# EAGLE design APA102 Shield (EAGLE 7.5.0)
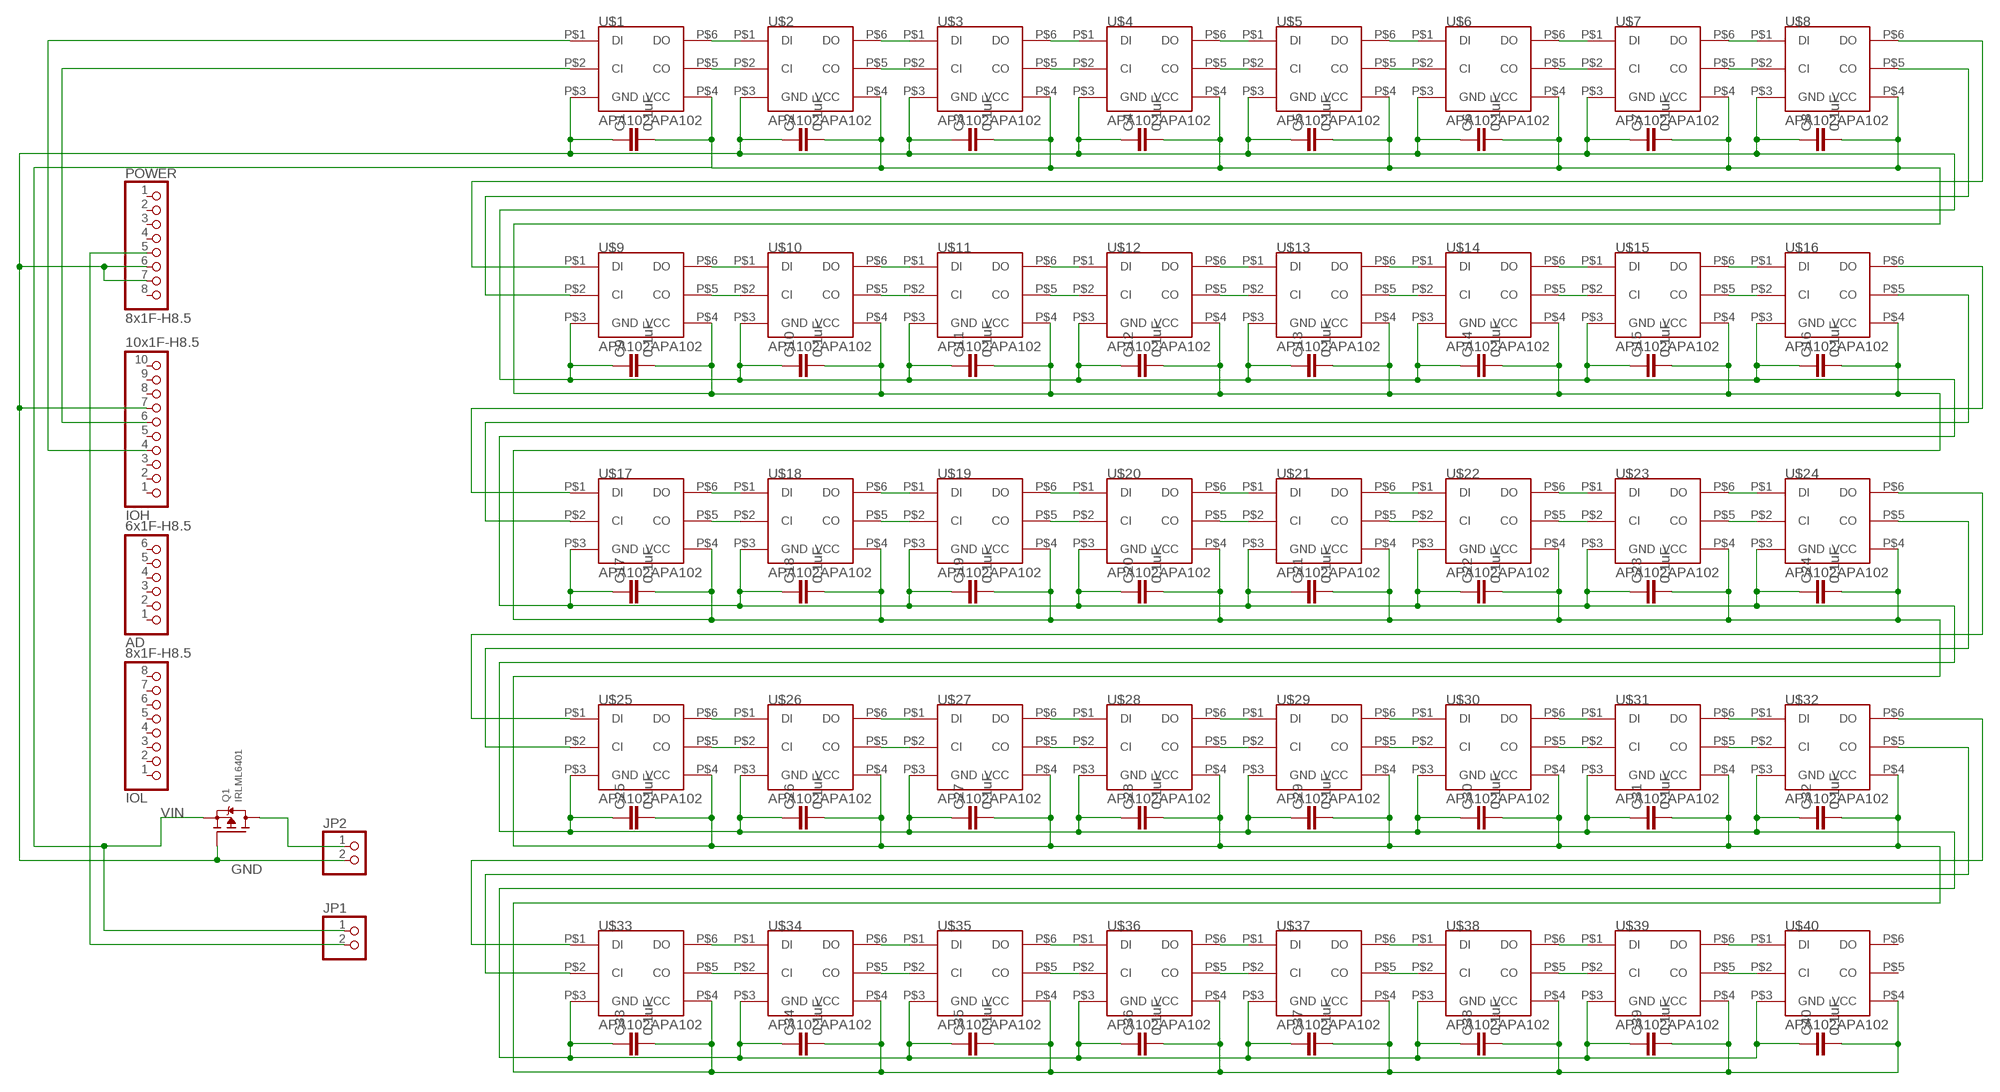
[diagram p0: schematic, sheet 1]

## Parts
AD  6x1F-H8.5  PINHD-1X6  [1X06]
C1  0.1uF  C-EUC1206  [C1206]
C2  0.1uF  C-EUC1206  [C1206]
C3  0.1uF  C-EUC1206  [C1206]
C4  0.1uF  C-EUC1206  [C1206]
C5  0.1uF  C-EUC1206  [C1206]
C6  0.1uF  C-EUC1206  [C1206]
C7  0.1uF  C-EUC1206  [C1206]
C8  0.1uF  C-EUC1206  [C1206]
C9  0.1uF  C-EUC1206  [C1206]
C10  0.1uF  C-EUC1206  [C1206]
C11  0.1uF  C-EUC1206  [C1206]
C12  0.1uF  C-EUC1206  [C1206]
C13  0.1uF  C-EUC1206  [C1206]
C14  0.1uF  C-EUC1206  [C1206]
C15  0.1uF  C-EUC1206  [C1206]
C16  0.1uF  C-EUC1206  [C1206]
C17  0.1uF  C-EUC1206  [C1206]
C18  0.1uF  C-EUC1206  [C1206]
C19  0.1uF  C-EUC1206  [C1206]
C20  0.1uF  C-EUC1206  [C1206]
C21  0.1uF  C-EUC1206  [C1206]
C22  0.1uF  C-EUC1206  [C1206]
C23  0.1uF  C-EUC1206  [C1206]
C24  0.1uF  C-EUC1206  [C1206]
C25  0.1uF  C-EUC1206  [C1206]
C26  0.1uF  C-EUC1206  [C1206]
C27  0.1uF  C-EUC1206  [C1206]
C28  0.1uF  C-EUC1206  [C1206]
C29  0.1uF  C-EUC1206  [C1206]
C30  0.1uF  C-EUC1206  [C1206]
C31  0.1uF  C-EUC1206  [C1206]
C32  0.1uF  C-EUC1206  [C1206]
C33  0.1uF  C-EUC1206  [C1206]
C34  0.1uF  C-EUC1206  [C1206]
C35  0.1uF  C-EUC1206  [C1206]
C36  0.1uF  C-EUC1206  [C1206]
C37  0.1uF  C-EUC1206  [C1206]
C38  0.1uF  C-EUC1206  [C1206]
C39  0.1uF  C-EUC1206  [C1206]
C40  0.1uF  C-EUC1206  [C1206]
IOH  10x1F-H8.5  PINHD-1X10_ARD  [1X10]
IOL  8x1F-H8.5  PINHD-1X8  [1X08]
JP1  PINHD-1X2  [1X02]
JP2  PINHD-1X2  [1X02]
POWER  8x1F-H8.5  PINHD-1X8  [1X08]
Q1  IRLML6401  MOSFET-PWIDE  [SOT23-WIDE]
U$1  APA102APA102  [5050]
U$2  APA102APA102  [5050]
U$3  APA102APA102  [5050]
U$4  APA102APA102  [5050]
U$5  APA102APA102  [5050]
U$6  APA102APA102  [5050]
U$7  APA102APA102  [5050]
U$8  APA102APA102  [5050]
U$9  APA102APA102  [5050]
U$10  APA102APA102  [5050]
U$11  APA102APA102  [5050]
U$12  APA102APA102  [5050]
U$13  APA102APA102  [5050]
U$14  APA102APA102  [5050]
U$15  APA102APA102  [5050]
U$16  APA102APA102  [5050]
U$17  APA102APA102  [5050]
U$18  APA102APA102  [5050]
U$19  APA102APA102  [5050]
U$20  APA102APA102  [5050]
U$21  APA102APA102  [5050]
U$22  APA102APA102  [5050]
U$23  APA102APA102  [5050]
U$24  APA102APA102  [5050]
U$25  APA102APA102  [5050]
U$26  APA102APA102  [5050]
U$27  APA102APA102  [5050]
U$28  APA102APA102  [5050]
U$29  APA102APA102  [5050]
U$30  APA102APA102  [5050]
U$31  APA102APA102  [5050]
U$32  APA102APA102  [5050]
U$33  APA102APA102  [5050]
U$34  APA102APA102  [5050]
U$35  APA102APA102  [5050]
U$36  APA102APA102  [5050]
U$37  APA102APA102  [5050]
U$38  APA102APA102  [5050]
U$39  APA102APA102  [5050]
U$40  APA102APA102  [5050]

## Nets
GND: C1.1 C2.1 C3.1 C4.1 C5.1 C6.1 C7.1 C8.1 C9.1 C10.1 C11.1 C12.1 C13.1 C14.1 C15.1 C16.1 C17.1 C18.1 C19.1 C20.1 C21.1 C22.1 C23.1 C24.1 C25.1 C26.1 C27.1 C28.1 C29.1 C30.1 C31.1 C32.1 C33.1 C34.1 C35.1 C36.1 C37.1 C38.1 C39.1 C40.1 IOH.7 JP2.2 POWER.6 POWER.7 Q1.1(G) U$1.P$3(GND) U$2.P$3(GND) U$3.P$3(GND) U$4.P$3(GND) U$5.P$3(GND) U$6.P$3(GND) U$7.P$3(GND) U$8.P$3(GND) U$9.P$3(GND) U$10.P$3(GND) U$11.P$3(GND) U$12.P$3(GND) U$13.P$3(GND) U$14.P$3(GND) U$15.P$3(GND) U$16.P$3(GND) U$17.P$3(GND) U$18.P$3(GND) U$19.P$3(GND) U$20.P$3(GND) U$21.P$3(GND) U$22.P$3(GND) U$23.P$3(GND) U$24.P$3(GND) U$25.P$3(GND) U$26.P$3(GND) U$27.P$3(GND) U$28.P$3(GND) U$29.P$3(GND) U$30.P$3(GND) U$31.P$3(GND) U$32.P$3(GND) U$33.P$3(GND) U$34.P$3(GND) U$35.P$3(GND) U$36.P$3(GND) U$37.P$3(GND) U$38.P$3(GND) U$39.P$3(GND) U$40.P$3(GND)
N$2: IOH.4 U$1.P$1(DI)
N$3: U$15.P$5(CO) U$16.P$2(CI)
N$4: U$23.P$6(DO) U$24.P$1(DI)
N$5: U$15.P$6(DO) U$16.P$1(DI)
N$6: IOH.6 U$1.P$2(CI)
N$7: U$14.P$6(DO) U$15.P$1(DI)
N$8: U$14.P$5(CO) U$15.P$2(CI)
N$9: U$7.P$6(DO) U$8.P$1(DI)
N$10: U$7.P$5(CO) U$8.P$2(CI)
N$11: U$6.P$6(DO) U$7.P$1(DI)
N$12: U$6.P$5(CO) U$7.P$2(CI)
N$13: U$5.P$6(DO) U$6.P$1(DI)
N$14: U$5.P$5(CO) U$6.P$2(CI)
N$15: U$4.P$6(DO) U$5.P$1(DI)
N$16: U$4.P$5(CO) U$5.P$2(CI)
N$17: U$3.P$6(DO) U$4.P$1(DI)
N$18: U$3.P$5(CO) U$4.P$2(CI)
N$19: U$2.P$6(DO) U$3.P$1(DI)
N$20: U$2.P$5(CO) U$3.P$2(CI)
N$21: U$1.P$6(DO) U$2.P$1(DI)
N$22: U$1.P$5(CO) U$2.P$2(CI)
N$23: U$23.P$5(CO) U$24.P$2(CI)
N$24: U$13.P$6(DO) U$14.P$1(DI)
N$25: U$22.P$6(DO) U$23.P$1(DI)
N$26: U$13.P$5(CO) U$14.P$2(CI)
N$27: U$12.P$6(DO) U$13.P$1(DI)
N$28: U$12.P$5(CO) U$13.P$2(CI)
N$29: U$11.P$6(DO) U$12.P$1(DI)
N$30: U$11.P$5(CO) U$12.P$2(CI)
N$31: U$10.P$6(DO) U$11.P$1(DI)
N$32: U$10.P$5(CO) U$11.P$2(CI)
N$33: U$9.P$6(DO) U$10.P$1(DI)
N$34: U$9.P$5(CO) U$10.P$2(CI)
N$35: U$22.P$5(CO) U$23.P$2(CI)
N$36: U$16.P$5(CO) U$17.P$2(CI)
N$37: U$8.P$5(CO) U$9.P$2(CI)
N$38: U$8.P$6(DO) U$9.P$1(DI)
N$39: U$16.P$6(DO) U$17.P$1(DI)
N$40: U$39.P$6(DO) U$40.P$1(DI)
N$41: U$21.P$6(DO) U$22.P$1(DI)
N$42: U$21.P$5(CO) U$22.P$2(CI)
N$43: U$20.P$6(DO) U$21.P$1(DI)
N$44: U$20.P$5(CO) U$21.P$2(CI)
N$45: U$19.P$6(DO) U$20.P$1(DI)
N$46: U$19.P$5(CO) U$20.P$2(CI)
N$47: U$18.P$6(DO) U$19.P$1(DI)
N$48: U$18.P$5(CO) U$19.P$2(CI)
N$49: U$17.P$6(DO) U$18.P$1(DI)
N$50: U$17.P$5(CO) U$18.P$2(CI)
N$51: U$39.P$5(CO) U$40.P$2(CI)
N$52: U$38.P$6(DO) U$39.P$1(DI)
N$53: U$31.P$6(DO) U$32.P$1(DI)
N$54: U$31.P$5(CO) U$32.P$2(CI)
N$55: U$30.P$6(DO) U$31.P$1(DI)
N$56: U$30.P$5(CO) U$31.P$2(CI)
N$57: U$29.P$6(DO) U$30.P$1(DI)
N$58: U$29.P$5(CO) U$30.P$2(CI)
N$59: U$28.P$6(DO) U$29.P$1(DI)
N$60: U$28.P$5(CO) U$29.P$2(CI)
N$61: U$27.P$6(DO) U$28.P$1(DI)
N$62: U$27.P$5(CO) U$28.P$2(CI)
N$63: U$26.P$6(DO) U$27.P$1(DI)
N$64: U$26.P$5(CO) U$27.P$2(CI)
N$65: U$25.P$6(DO) U$26.P$1(DI)
N$66: U$25.P$5(CO) U$26.P$2(CI)
N$67: U$38.P$5(CO) U$39.P$2(CI)
N$69: U$24.P$5(CO) U$25.P$2(CI)
N$70: U$24.P$6(DO) U$25.P$1(DI)
N$71: JP1.2 POWER.5
N$72: JP2.1 Q1.3(D)
N$73: U$37.P$6(DO) U$38.P$1(DI)
N$74: U$37.P$5(CO) U$38.P$2(CI)
N$75: U$36.P$6(DO) U$37.P$1(DI)
N$76: U$36.P$5(CO) U$37.P$2(CI)
N$77: U$35.P$6(DO) U$36.P$1(DI)
N$78: U$35.P$5(CO) U$36.P$2(CI)
N$79: U$34.P$6(DO) U$35.P$1(DI)
N$80: U$34.P$5(CO) U$35.P$2(CI)
N$81: U$33.P$6(DO) U$34.P$1(DI)
N$82: U$33.P$5(CO) U$34.P$2(CI)
N$85: U$32.P$5(CO) U$33.P$2(CI)
N$86: U$32.P$6(DO) U$33.P$1(DI)
VIN: C1.2 C2.2 C3.2 C4.2 C5.2 C6.2 C7.2 C8.2 C9.2 C10.2 C11.2 C12.2 C13.2 C14.2 C15.2 C16.2 C17.2 C18.2 C19.2 C20.2 C21.2 C22.2 C23.2 C24.2 C25.2 C26.2 C27.2 C28.2 C29.2 C30.2 C31.2 C32.2 C33.2 C34.2 C35.2 C36.2 C37.2 C38.2 C39.2 C40.2 JP1.1 Q1.2(S) U$1.P$4(VCC) U$2.P$4(VCC) U$3.P$4(VCC) U$4.P$4(VCC) U$5.P$4(VCC) U$6.P$4(VCC) U$7.P$4(VCC) U$8.P$4(VCC) U$9.P$4(VCC) U$10.P$4(VCC) U$11.P$4(VCC) U$12.P$4(VCC) U$13.P$4(VCC) U$14.P$4(VCC) U$15.P$4(VCC) U$16.P$4(VCC) U$17.P$4(VCC) U$18.P$4(VCC) U$19.P$4(VCC) U$20.P$4(VCC) U$21.P$4(VCC) U$22.P$4(VCC) U$23.P$4(VCC) U$24.P$4(VCC) U$25.P$4(VCC) U$26.P$4(VCC) U$27.P$4(VCC) U$28.P$4(VCC) U$29.P$4(VCC) U$30.P$4(VCC) U$31.P$4(VCC) U$32.P$4(VCC) U$33.P$4(VCC) U$34.P$4(VCC) U$35.P$4(VCC) U$36.P$4(VCC) U$37.P$4(VCC) U$38.P$4(VCC) U$39.P$4(VCC) U$40.P$4(VCC)
Unconnected: AD.1 AD.2 AD.3 AD.4 AD.5 AD.6 IOH.1 IOH.2 IOH.3 IOH.5 IOH.8 IOH.9 IOH.10 IOL.1 IOL.2 IOL.3 IOL.4 IOL.5 IOL.6 IOL.7 IOL.8 POWER.1 POWER.2 POWER.3 POWER.4 POWER.8 U$40.P$5(CO) U$40.P$6(DO)

## Library data of the parts
AD = SmartPrj:PINHD-1X6: PIN HEADER
C1-C40 = rcl:C-EU: CAPACITOR, European symbol
IOH = SmartPrj:PINHD-1X10_ARD: PIN HEADER
IOL POWER = SmartPrj:PINHD-1X8: PIN HEADER
JP1 JP2 = pinhead:PINHD-1X2: PIN HEADER
Q1 = microbuilder:MOSFET-P: P-Channel Mosfet LEGEND VDS: Voltage Drain-Source ID: Drain Current RDS(ON): Drain-Source On-State Resistance VGS(TH): Gate-Source Threshold Voltage CISS: Drain-Source Input Capacitance SOT-23 Name VDS ID RDS(ON) VGS(TH) CISS Order Number IRLML5103 30V 760mA 600 mOhm -- 75pF @ 25V Digikey: IRLML5103PBFCT-ND NTR0202PL 20V 400mA 800 mOhm 2.3V @ 250uA 70pF @ 5V Digikey: NTR0202PLT1GOSTR-ND NTR4101PT1G 20V 1.8A 85 mOhm 1.2V @ 250uA 675pF @ 10V Digikey: NTR4101PT1GOSCT-ND DMP2004K 20V 600mA 900 mOhm 1V @ 250uA 175pF @ 16V Digikey: DMP2004KDICT-ND PMV65XP 20V 3.9A 76 mOhm 950mV @ 1mA 725pF @ 20V Digikey: 568-2358-2-ND TO-252 Name VDS ID RDS(ON) VGS(TH) CISS Order Number AOD417 30V 25A 34 mOhm 3V @ 250µA 920pF @ 15V Digikey: 785-1106-2-ND
U$1-U$40 = Joe:APA102

## Net classes
1 power: width 0.61 mm, drill 0.61 mm, clearance 0.254 mm
2 gnd: width 0.305 mm, drill 0.559 mm, clearance 0.254 mm
3 usbvcc: width 0.508 mm, drill 0.61 mm, clearance 0.254 mm
4 aref: width 0.406 mm, drill 0.61 mm, clearance 0.254 mm

## Board
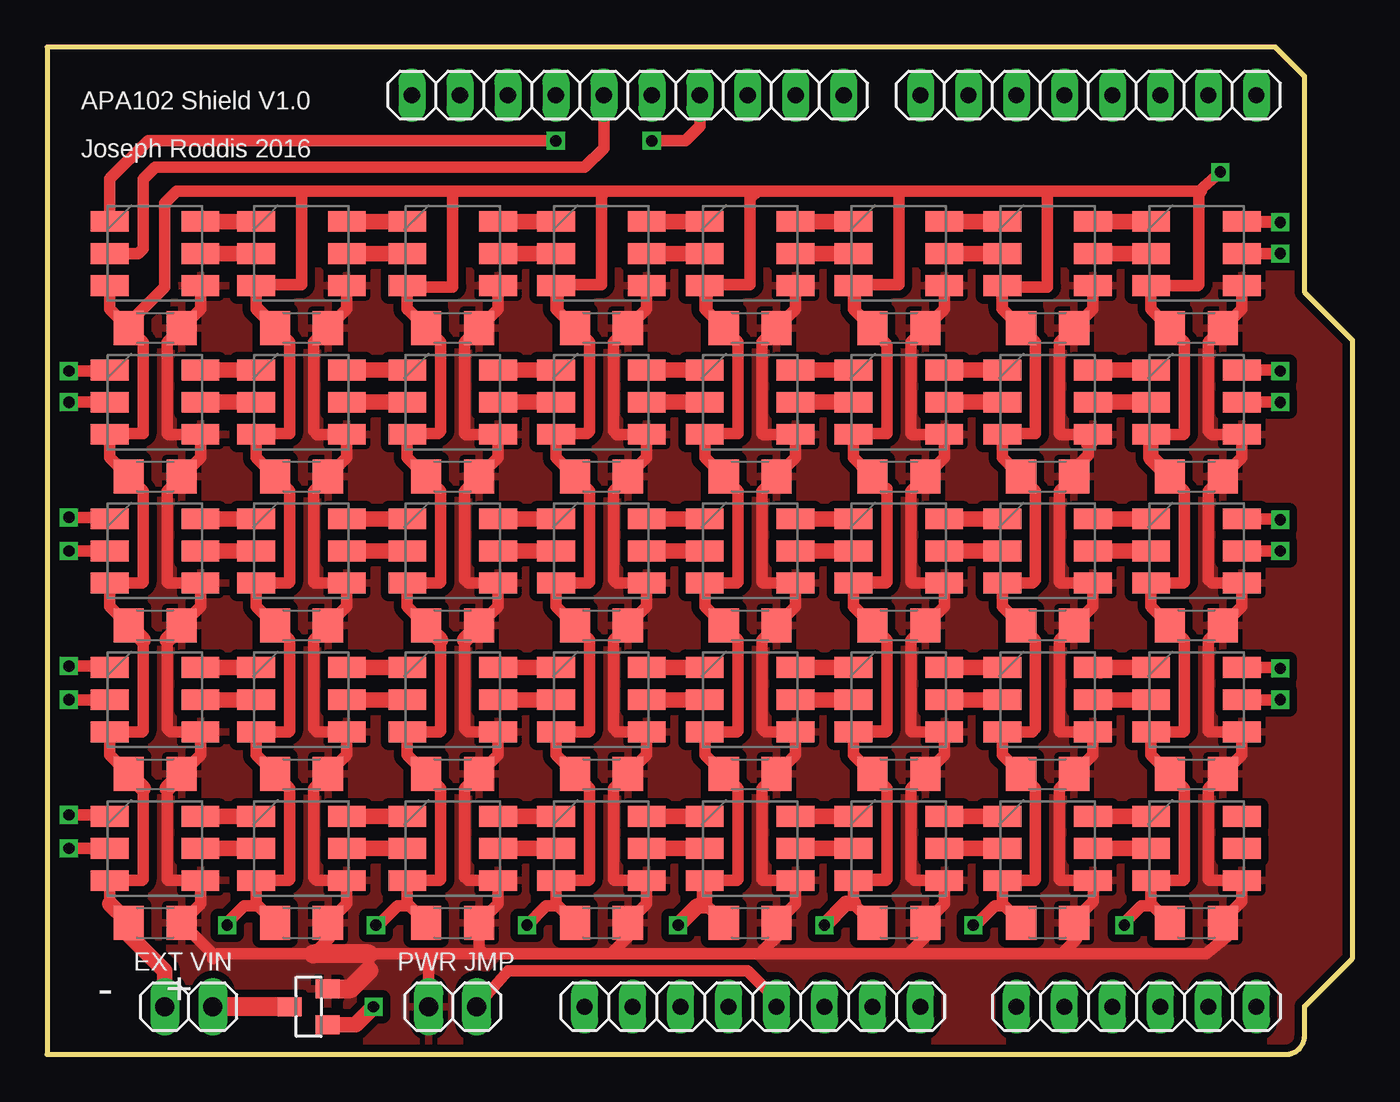
[diagram p1: board, top side]
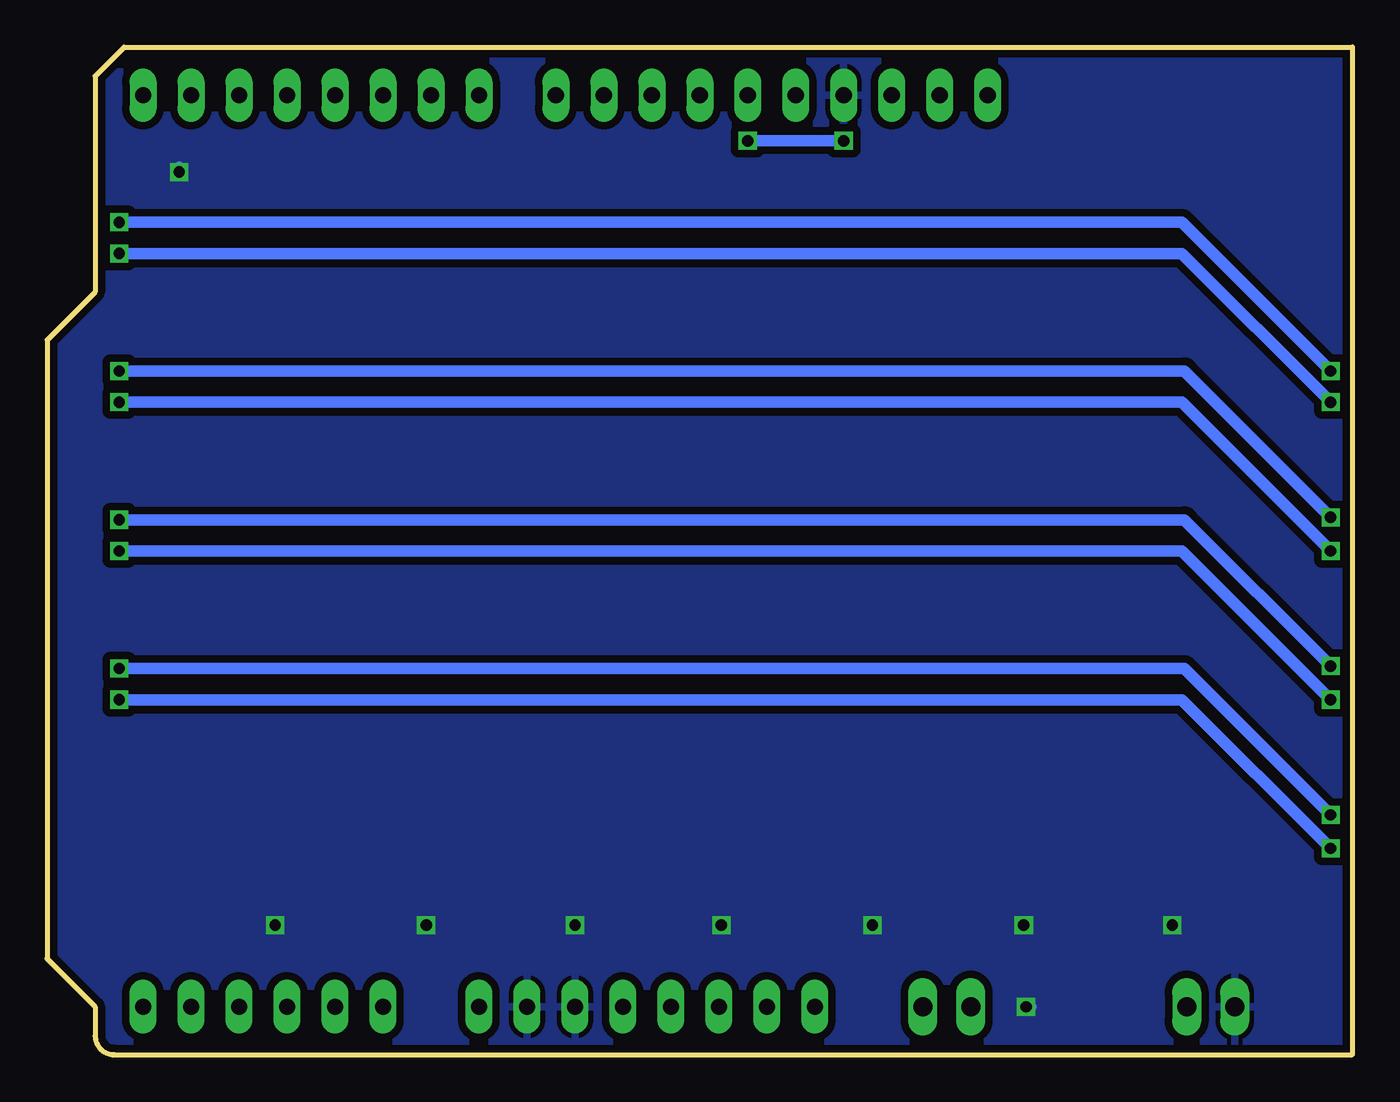
[diagram p2: board, bottom side, seen from below]

Size 69.09 x 53.34 mm. Coordinates in mm from the lower left corner, seen from the top.
Outline: 65.55,0 arc90 66.55,1 66.55,2.54 69.09,5.08 69.09,37.85 66.55,40.39 66.55,51.82 65.02,53.34 0,53.34 0,0 65.53,0
Copper layers (1*16): Top 0.0356mm / dielectric 1.5011mm / Bottom 0.0356mm
Design rules "oshpark-2layer": minimum track width 6mil, minimum drill 13mil, track to track 6mil, track to pad 6mil, pad to pad 6mil, via to via 6mil, smd to smd 6mil, copper to edge 15mil, drill to drill 6mil, minimum pad ring 7mil, minimum via ring 7mil, stop-mask expansion 2.5mil, vias tented up to drill 0mil, thermal gap 10mil
vRestrict: area 23.4,44.1 to 25.1,49.1; area 25.9,45.5 to 27.6,49.1; area 29,45.3 to 30.1,48.8; area 31.5,45.3 to 32.6,48.8; area 34,45.3 to 35.2,48.8; area 36.6,45.3 to 37.7,48.8; area 39.2,47.2 to 40.4,48.8; area 40.8,45.1 to 48.1,46.9; area 60.8,44.2 to 62.2,46.7; area 63.4,44.2 to 64.8,46.7; area 61.8,35.8 to 65.3,37.2; area 1.1,21.8 to 2.5,30.1; 14 more areas

### Footprints (pad centres in the part's own frame; a part is rotated, then mirrored left to right if it is on the bottom)
1X06 = drill 0.85 pad 1.422 long: 1 -6.35,0; 2 -3.81,0; 3 -1.27,0; 4 1.27,0; 5 3.81,0; 6 6.35,0
C1206 = smd 1.6 x 1.8: 1 -1.4,0; 2 1.4,0
1X10 = drill 0.85 pad 1.422 long: 1 -11.43,0; 2 -8.89,0; 3 -6.35,0; 4 -3.81,0; 5 -1.27,0; 6 1.27,0; 7 3.81,0; 8 6.35,0; 9 8.89,0; 10 11.43,0
1X08 = drill 0.85 pad 1.422 long: 1 -8.89,0; 2 -6.35,0; 3 -3.81,0; 4 -1.27,0; 5 1.27,0; 6 3.81,0; 7 6.35,0; 8 8.89,0
1X02 = drill 1.016 long: 1 -1.27,0; 2 1.27,0
SOT23-WIDE = smd 1 x 1.27: 1 -0.95,-1; 2 0.95,-1; 3 0,1
5050 = smd 2 x 1.1: P$1 -2.4,1.7; P$2 -2.4,0; P$3 -2.4,-1.7; P$4 2.4,-1.7; P$5 2.4,0; P$6 2.4,1.7

### Placement (x,y rotation side)
AD  57.66,2.54 0 top
C1  5.71,38.48 0 top
C2  13.46,38.48 0 top
C3  21.46,38.48 0 top
C4  29.34,38.48 0 top
C5  37.21,38.48 0 top
C6  45.09,38.48 0 top
C7  52.96,38.48 0 top
C8  60.83,38.48 0 top
C9  5.71,30.61 0 top
C10  13.46,30.61 0 top
C11  21.46,30.61 0 top
C12  29.34,30.61 0 top
C13  37.21,30.61 0 top
C14  45.09,30.61 0 top
C15  52.96,30.61 0 top
C16  60.83,30.61 0 top
C17  5.71,22.73 0 top
C18  13.46,22.73 0 top
C19  21.46,22.73 0 top
C20  29.34,22.73 0 top
C21  37.21,22.73 0 top
C22  45.09,22.73 0 top
C23  52.96,22.73 0 top
C24  60.83,22.73 0 top
C25  5.71,14.86 0 top
C26  13.46,14.86 0 top
C27  21.46,14.86 0 top
C28  29.34,14.86 0 top
C29  37.21,14.86 0 top
C30  45.09,14.86 0 top
C31  52.96,14.86 0 top
C32  60.83,14.86 0 top
C33  5.71,6.99 0 top
C34  13.46,6.99 0 top
C35  21.46,6.99 0 top
C36  29.34,6.99 0 top
C37  37.21,6.99 0 top
C38  45.09,6.99 0 top
C39  52.96,6.99 0 top
C40  60.83,6.99 0 top
IOH  30.73,50.8 180 top
IOL  55.12,50.8 180 top
JP1  21.46,2.54 0 top
JP2  7.49,2.54 180 top
POWER  37.34,2.54 0 top
Q1  13.84,2.54 90 top
U$1  5.71,42.42 0 top
U$2  13.46,42.42 0 top
U$3  21.46,42.42 0 top
U$4  29.34,42.42 0 top
U$5  37.21,42.42 0 top
U$6  45.09,42.42 0 top
U$7  52.96,42.42 0 top
U$8  60.83,42.42 0 top
U$9  5.71,34.54 0 top
U$10  13.46,34.54 0 top
U$11  21.46,34.54 0 top
U$12  29.34,34.54 0 top
U$13  37.21,34.54 0 top
U$14  45.09,34.54 0 top
U$15  52.96,34.54 0 top
U$16  60.83,34.54 0 top
U$17  5.71,26.67 0 top
U$18  13.46,26.67 0 top
U$19  21.46,26.67 0 top
U$20  29.34,26.67 0 top
U$21  37.21,26.67 0 top
U$22  45.09,26.67 0 top
U$23  52.96,26.67 0 top
U$24  60.83,26.67 0 top
U$25  5.71,18.8 0 top
U$26  13.46,18.8 0 top
U$27  21.46,18.8 0 top
U$28  29.34,18.8 0 top
U$29  37.21,18.8 0 top
U$30  45.09,18.8 0 top
U$31  52.96,18.8 0 top
U$32  60.83,18.8 0 top
U$33  5.71,10.92 0 top
U$34  13.46,10.92 0 top
U$35  21.46,10.92 0 top
U$36  29.34,10.92 0 top
U$37  37.21,10.92 0 top
U$38  45.09,10.92 0 top
U$39  52.96,10.92 0 top
U$40  60.83,10.92 0 top

### Tracks (layer width: path | path; a pad name or v marks a point on that pad's centre or on a via)
GND  (via drill 0.6)
  Top 0.61: U$1.P$3 3.31,39.48 C1.1 | U$2.P$3 11.06,39.48 C2.1 | U$7.P$3 50.56,39.48 C7.1 | U$6.P$3 42.69,39.48 C6.1 | U$5.P$3 34.81,39.48 C5.1 | U$4.P$3 26.94,39.48 C4.1 | C17.1 3.31,23.73 U$17.P$3 5.03,24.97 5.08,25.02 5.08,29.84 C9.1 3.31,31.61 U$9.P$3 3.36,32.89 5.08,32.89 5.08,37.72 C1.1 | C25.1 3.31,15.86 U$25.P$3 5.03,17.1 5.08,17.14 5.08,21.97 | 3.31,7.99 U$33.P$3 5.03,9.22 5.08,9.27 5.08,14.1 | 3.68,7.62 C33.1 4.31,6.35 | 11.06,8.13 U$34.P$3 12.78,9.22 12.83,9.27 12.83,14.1 12.82,14.1 C26.1 11.06,15.86 U$26.P$3 12.78,17.1 12.83,17.14 12.83,21.97 12.82,21.97 C18.1 11.06,23.73 U$18.P$3 12.78,24.97 12.83,25.02 12.83,29.84 C10.1 11.06,31.61 U$10.P$3 11.11,32.89 12.83,32.89 12.83,37.72 C2.1 | 11.06,8.13 11.06,7.99 C34.1 | 19.17,7.87 19.06,7.99 U$35.P$3 20.78,9.22 20.83,9.27 20.83,14.09 C27.1 19.06,15.86 U$27.P$3 20.78,17.1 20.83,17.14 20.83,21.97 | 19.17,7.87 C35.1 | C36.1 26.94,7.99 U$36.P$3 28.65,9.22 28.7,9.27 28.7,14.1 C28.1 26.94,15.86 U$28.P$3 28.65,17.1 28.7,17.14 28.7,21.97 C20.1 26.94,23.73 U$20.P$3 28.65,24.97 28.7,25.02 28.7,29.84 C12.1 26.94,31.61 U$12.P$3 26.99,32.89 28.57,32.89 28.7,33.02 28.7,37.72 C4.1 | C37.1 34.81,7.99 U$37.P$3 36.53,9.22 36.58,9.27 36.58,14.09 C29.1 34.81,15.86 U$29.P$3 36.53,17.1 36.58,17.14 36.58,21.97 C21.1 34.81,23.73 U$21.P$3 36.53,24.97 36.58,25.02 36.58,29.84 C13.1 34.81,31.61 U$13.P$3 34.86,32.89 36.58,32.89 36.58,37.72 C5.1 | 42.69,7.99 U$38.P$3 44.4,9.22 44.45,9.27 44.45,9.4 | 42.69,7.99 43.05,7.62 | 43.05,7.62 C38.1 43.05,7.62 | 50.61,7.94 50.56,7.99 U$39.P$3 52.28,9.22 52.32,9.27 52.32,14.09 C31.1 50.56,15.86 U$31.P$3 52.15,17.1 52.32,17.27 52.32,21.97 C23.1 50.56,23.73 U$23.P$3 52.15,24.97 52.32,25.15 52.32,29.84 C15.1 50.56,31.61 U$15.P$3 50.61,32.89 52.32,32.89 52.32,37.72 C7.1
  Top 0.61: 50.61,7.94 C39.1 | 58.43,7.99 U$40.P$3 60.15,9.22 60.2,9.27 60.2,14.09 C32.1 58.43,15.86 U$32.P$3 60.15,17.1 60.2,17.14 60.2,21.97 C24.1 58.43,23.73 U$24.P$3 60.15,24.97 60.2,25.02 60.2,29.84 C16.1 | 58.43,7.99 C40.1 | C19.1 19.06,23.73 U$19.P$3 20.78,24.97 20.83,25.02 20.83,29.84 C11.1 19.06,31.61 U$11.P$3 19.11,32.89 20.7,32.89 20.83,33.02 20.83,37.72 C3.1 | 44.45,29.84 C14.1 42.69,31.61 U$14.P$3 42.73,32.89 44.45,32.89 44.45,37.59 43.69,38.36 C6.1 | 44.45,29.84 44.45,25.15 | 44.45,25.15 44.45,25.02 44.4,24.97 U$22.P$3 42.69,23.73 C22.1 44.45,21.97 | 44.45,21.97 44.45,17.14 | 44.45,17.14 44.4,17.1 U$30.P$3 42.69,15.86 C30.1 44.45,14.09 | 44.45,14.09 44.45,9.4 | U$16.P$3 60.15,32.84 60.2,32.89 60.2,37.72 C8.1 58.43,39.48 U$8.P$3 60.91,40.72 60.96,40.77 60.96,45.59 | U$3.P$3 19.06,39.48 19.18,39.37 C3.1 | C1.1 4.31,38.73 6.22,40.64 6.22,45.09 6.86,45.72 13.46,45.72 | 13.46,45.72 21.46,45.72 | 21.46,45.72 29.59,45.72 | 29.59,45.72 37.59,45.72 | 37.59,45.72 45.09,45.72 | 45.09,45.72 53.09,45.72 | 53.09,45.72 60.83,45.72 60.96,45.59 | C7.1 50.55,39.5 50.55,40.64 52.96,40.64 52.96,45.59 53.09,45.72 | C6.1 42.8,39.37 42.8,40.64 42.67,40.77 45.09,40.77 45.09,45.72 | C5.1 34.93,39.37 34.93,40.77 37.21,40.77 37.21,45.34 37.59,45.72 | C4.1 27.05,39.37 27.05,40.64 26.92,40.77 29.34,40.77 29.34,45.47 29.59,45.72 | C3.1 19.05,39.5 19.05,40.64 21.46,40.64 21.46,45.72 | C2.1 12.06,38.61 11.18,39.5 11.05,39.5 11.05,40.77 13.46,40.77 13.46,45.72 | 61.09,45.72 60.96,45.59 | 42.69,7.99 42.67,8 42.67,9.27 43.18,9.27 43.31,9.14 43.31,9.27 44.32,9.27 44.45,9.4 | 44.45,14.09 44.45,14.1 42.67,15.88 42.67,17.02 43.05,17.02
  Top 0.61: 43.05,17.02 43.18,17.14 43.31,17.14 | 43.31,17.14 43.43,17.14 | 43.43,17.14 43.56,17.02 43.18,17.02 | 43.05,17.02 43.18,17.02 | 43.18,17.02 43.31,17.14 | 43.43,17.14 44.45,17.14 | 44.45,21.97 42.67,23.75 42.67,25.02 44.32,25.02 44.45,25.15 | 44.45,29.84 44.45,29.97 44.2,29.97 43.43,30.73 43.43,30.86 42.67,31.62 42.67,32.77 | 42.8,32.89 42.67,32.89 42.67,32.77 | 42.8,32.89 42.67,32.77 | 42.8,32.89 42.93,32.89 43.05,33.02 | 9.4,6.86 10.41,7.87 11.05,7.87 11.05,8.12 11.06,8.13 | 19.17,7.87 18.54,7.87 17.4,6.73 | 26.92,7.87 26.42,7.87 v25.4,6.86 | 49.02,6.73 50.16,7.87 50.55,7.87 50.61,7.94 | 58.55,7.87 58.42,7.87 | 58.42,7.87 57.91,7.87 56.9,6.86 | 58.43,7.99 58.43,7.89 58.42,7.87 | 45.09,45.72 60.96,45.72 v62.1,46.74
  Top 0.813: 3.31,7.99 3.68,7.62 | U$16.P$3 58.43,31.61 C16.1 | C17.1 5.08,21.97 | C25.1 5.08,14.1 | C19.1 20.83,21.97 | JP2.2 6.22,4.45 4.31,6.35 | Q1.1 16.32,1.59 v17.27,2.54 | 42.67,8 42.29,8 v41.15,6.86 | v33.4,6.86 34.42,7.87 34.8,7.87 34.8,9.21 U$37.P$3
  Bottom 0.61: v17.27,2.54 17.02,2.54 | v62.1,46.74 62.1,46.99
  other vias: 9.52,6.86 17.4,6.86 49.02,6.86 57.02,6.86
  pour Bottom (isolate 0.406): 0,53.34 65.02,53.34 66.55,51.82 66.55,40.39 69.09,37.85 69.09,5.08 66.55,2.54 66.55,1.14 66.55,1.02 arc-90 65.53,0 0,0
N$2  (via drill 0.6)
  Top 0.61: U$1.P$1 3.31,46.37 5.33,48.39 v26.92,48.39 | v32,48.39 33.78,48.39 34.54,49.15 IOH.4
  Bottom 0.61: v26.92,48.39 v32,48.39
N$3
  Top 0.813: U$15.P$5 U$16.P$2
N$4
  Top 0.813: U$23.P$6 U$24.P$1
N$5
  Top 0.813: U$15.P$6 U$16.P$1
N$6
  Top 0.61: U$1.P$2 4.83,42.42 5.08,42.67 5.08,46.35 5.71,46.99 28.45,46.99 29.46,48.01 IOH.6
N$7
  Top 0.813: U$14.P$6 U$15.P$1
N$8
  Top 0.813: U$14.P$5 U$15.P$2
N$9
  Top 0.813: U$7.P$6 U$8.P$1
N$10
  Top 0.813: U$7.P$5 U$8.P$2
N$11
  Top 0.813: U$6.P$6 U$7.P$1
N$12
  Top 0.813: U$6.P$5 U$7.P$2
N$13
  Top 0.813: U$5.P$6 U$6.P$1
N$14
  Top 0.813: U$5.P$5 U$6.P$2
N$15
  Top 0.813: U$4.P$6 U$5.P$1
N$16
  Top 0.813: U$4.P$5 U$5.P$2
N$17
  Top 0.813: U$3.P$6 U$4.P$1
N$18
  Top 0.813: U$3.P$5 U$4.P$2
N$19
  Top 0.813: U$2.P$6 U$3.P$1
N$20
  Top 0.813: U$2.P$5 U$3.P$2
N$21
  Top 0.813: U$1.P$6 U$2.P$1
N$22
  Top 0.813: U$1.P$5 U$2.P$2
N$23
  Top 0.813: U$23.P$5 U$24.P$2
N$24
  Top 0.813: U$13.P$6 U$14.P$1
N$25
  Top 0.813: U$22.P$6 U$23.P$1
N$26
  Top 0.813: U$13.P$5 U$14.P$2
N$27
  Top 0.813: U$12.P$6 U$13.P$1
N$28
  Top 0.813: U$12.P$5 U$13.P$2
N$29
  Top 0.813: U$11.P$6 U$12.P$1
N$30
  Top 0.813: U$11.P$5 U$12.P$2
N$31
  Top 0.813: U$10.P$6 18.29,36.24 18.29,36.2 19.06,36.2 U$11.P$1
N$32
  Top 0.813: U$10.P$5 U$11.P$2
N$33
  Top 0.813: U$9.P$6 10.67,36.24 10.67,36.2 11.06,36.2 U$10.P$1
N$34
  Top 0.813: U$9.P$5 U$10.P$2
N$35
  Top 0.813: U$22.P$5 U$23.P$2
N$36  (via drill 0.6)
  Top 0.61: U$16.P$5 v65.28,34.54 | v1.14,26.67 U$17.P$2
  Bottom 0.61: v65.28,34.54 9.02,34.54 v1.14,26.67
N$37  (via drill 0.6)
  Top 0.61: U$9.P$2 3.19,34.42 3.17,34.42 3.05,34.29 2.79,34.54 | 2.79,34.54 U$9.P$2 | U$9.P$2 3.43,34.54 | U$8.P$5 v65.28,42.42 | v1.14,34.54 2.79,34.54
  Bottom 0.61: v65.28,42.42 9.02,42.42 v1.14,34.54
N$38  (via drill 0.6)
  Top 0.61: 65.02,44.07 63.28,44.07 U$8.P$6 65.23,44.12 v65.28,44.07 | v1.14,36.2 3.27,36.2 U$9.P$1
  Bottom 0.61: v65.28,44.07 9.02,44.07 v1.14,36.2
N$39  (via drill 0.6)
  Top 0.61: U$16.P$6 65.23,36.24 v65.28,36.2 | v1.14,28.45 3.24,28.45 U$17.P$1
  Bottom 0.61: v65.28,36.2 8.89,36.2 v1.14,28.45
N$40
  Top 0.813: U$39.P$6 U$40.P$1
N$41
  Top 0.813: U$21.P$6 U$22.P$1
N$42
  Top 0.813: U$21.P$5 U$22.P$2
N$43
  Top 0.813: U$20.P$6 U$21.P$1
N$44
  Top 0.813: U$20.P$5 U$21.P$2
N$45
  Top 0.813: U$19.P$6 U$20.P$1
N$46
  Top 0.813: U$19.P$5 U$20.P$2
N$47
  Top 0.813: U$18.P$6 U$19.P$1
N$48
  Top 0.813: U$18.P$5 U$19.P$2
N$49
  Top 0.813: U$17.P$6 U$18.P$1
N$50
  Top 0.813: U$17.P$5 U$18.P$2
N$51
  Top 0.813: U$39.P$5 U$40.P$2
N$52
  Top 0.813: U$38.P$6 U$39.P$1
N$53
  Top 0.813: U$32.P$1 56.39,20.5 55.75,20.5 | 55.75,20.5 55.75,20.32 | U$31.P$6 55.75,20.5
N$54
  Top 0.813: U$31.P$5 U$32.P$2
N$55
  Top 0.813: U$31.P$1 U$30.P$6
N$56
  Top 0.813: U$30.P$5 U$31.P$2
N$57
  Top 0.813: U$30.P$1 U$29.P$6
N$58
  Top 0.813: U$29.P$5 U$30.P$2
N$59
  Top 0.813: U$28.P$6 U$29.P$1
N$60
  Top 0.813: U$28.P$5 U$29.P$2
N$61
  Top 0.813: U$27.P$6 U$28.P$1
N$62
  Top 0.813: U$27.P$5 U$28.P$2
N$63
  Top 0.813: U$26.P$6 U$27.P$1
N$64
  Top 0.813: U$26.P$5 U$27.P$2
N$65
  Top 0.813: U$25.P$6 U$26.P$1
N$66
  Top 0.813: U$25.P$5 U$26.P$2
N$67
  Top 0.813: U$38.P$5 U$39.P$2
N$69  (via drill 0.6)
  Top 0.61: U$24.P$5 v65.28,26.67 | v1.14,18.8 U$25.P$2
  Bottom 0.61: v65.28,26.67 9.02,26.67 v1.14,18.8
N$70  (via drill 0.6)
  Top 0.61: 63.28,28.32 U$24.P$6 65.23,28.37 v65.28,28.32 | v1.14,20.57 3.24,20.57 U$25.P$1
  Bottom 0.61: v65.28,28.32 8.89,28.32 v1.14,20.57
N$71
  Top 0.61: POWER.5 38.61,2.92 37.08,4.45 24.38,4.45 JP1.2
N$72
  Top 1.016: Q1.3 JP2.1
N$73
  Top 0.813: U$37.P$6 U$38.P$1
N$74
  Top 0.813: U$37.P$5 U$38.P$2
N$75
  Top 0.813: U$36.P$6 U$37.P$1
N$76
  Top 0.813: U$36.P$5 U$37.P$2
N$77
  Top 0.813: U$35.P$6 U$36.P$1
N$78
  Top 0.813: U$35.P$5 U$36.P$2
N$79
  Top 0.813: U$34.P$6 U$35.P$1
N$80
  Top 0.813: U$34.P$5 U$35.P$2
N$81
  Top 0.813: U$33.P$6 U$34.P$1
N$82
  Top 0.813: U$33.P$5 U$34.P$2
N$85  (via drill 0.6)
  Top 0.61: 63.63,18.8 63.37,19.05 63.37,18.94 U$32.P$5 v65.28,18.8 | v1.14,10.92 U$33.P$2
  Bottom 0.61: v65.28,18.8 9.02,18.8 v1.14,10.92
N$86  (via drill 0.6)
  Top 0.61: 63.28,20.45 U$32.P$6 65.23,20.5 v65.28,20.45 | v1.14,12.7 3.24,12.7 U$33.P$1
  Bottom 0.61: v65.28,20.45 8.89,20.45 v1.14,12.7
VIN
  Top 0.61: U$1.P$4 8.12,39.48 C1.2 6.35,37.72 6.35,32.89 6.4,32.84 U$9.P$4 8.12,31.61 C9.2 6.35,29.84 6.35,25.02 6.4,24.97 U$17.P$4 8.12,23.73 C17.2 | U$2.P$4 15.86,39.48 C2.2 | U$7.P$4 55.36,39.48 C7.2 53.59,37.72 53.59,32.89 53.64,32.84 U$15.P$4 | U$8.P$4 63.23,39.48 C8.2 61.47,37.72 61.47,33.02 61.64,32.84 U$16.P$4 63.23,31.61 C16.2 61.47,29.84 61.47,25.15 61.64,24.97 U$24.P$4 63.23,23.73 C24.2 61.47,21.97 61.47,17.14 61.52,17.1 U$32.P$4 63.23,15.86 C32.2 61.47,14.09 61.47,9.27 61.52,9.22 U$40.P$4 63.23,8.12 62.74,7.62 62.74,7.49 C40.2 62.74,6.48 61.34,5.33 53.72,5.33 | U$6.P$4 47.48,39.48 C6.2 45.72,37.72 45.72,32.89 45.77,32.84 U$14.P$4 47.48,31.61 C14.2 45.72,29.84 45.72,25.02 45.77,24.97 U$22.P$4 47.48,23.73 C22.2 45.72,21.97 45.72,17.14 45.77,17.1 U$30.P$4 47.48,15.86 C30.2 45.72,14.09 45.72,9.4 45.9,9.22 U$38.P$4 47.48,7.99 C38.2 46.86,6.61 46.86,6.6 45.59,5.33 | U$5.P$4 39.61,39.48 C5.2 37.85,37.72 37.85,32.89 37.9,32.84 U$13.P$4 39.61,31.61 C13.2 37.85,29.84 37.85,25.02 37.9,24.97 U$21.P$4 39.61,23.73 C21.2 37.85,21.97 37.85,17.27 38.02,17.1 U$29.P$4 39.61,15.86 C29.2 37.85,14.09 37.85,9.27 37.9,9.22 U$37.P$4 39.61,7.99 C37.2 38.86,6.73 38.86,6.48 37.85,5.46 37.85,5.33 | U$4.P$4 31.74,39.48 C4.2 29.97,37.72 29.97,33.02 30.15,32.84 U$12.P$4 31.74,31.61 C12.2 29.97,29.84 29.97,25.15 30.15,24.97 U$20.P$4 31.74,23.73 C20.2 29.97,21.97 29.97,17.27 30.15,17.1 U$28.P$4 31.74,15.86 C28.2 29.97,14.09 29.97,9.27 30.02,9.22 U$36.P$4 31.74,7.99 C36.2 30.86,6.86 30.86,6.35 29.84,5.33 | U$3.P$4 23.86,39.48 C3.2 22.1,37.72 22.1,32.89 22.15,32.84 U$11.P$4 23.86,31.61 C11.2 22.1,29.84 22.1,25.15 22.27,24.97 U$19.P$4 23.86,23.73 C19.2
  Top 0.61: C25.2 8.12,15.86 U$25.P$4 6.53,17.1 6.35,17.27 6.35,21.97 | 55.12,32.38 55.12,31.75 54.48,31.11 54.48,30.73 | 15.11,38.73 14.1,37.72 14.1,33.02 14.27,32.84 U$10.P$4 15.86,31.61 C10.2 14.1,29.84 14.1,25.02 14.15,24.97 U$18.P$4 15.86,23.73 C18.2 14.1,21.97 14.1,17.27 14.27,17.1 U$26.P$4 15.86,15.86 C26.2 14.1,14.09 14.1,9.4 14.27,9.22 U$34.P$4 15.86,7.99 C34.2 14.99,6.86 14.99,6.22 14.1,5.33 9.02,5.33 8.76,5.08 8.76,5.34 C33.2 8.13,8 8.13,8.89 7.8,9.22 | 6.35,14.09 6.35,9.27 6.4,9.22 7.8,9.22 | 7.8,9.22 U$33.P$4 | U$39.P$4 53.64,9.22 53.59,9.27 53.59,14.09 C31.2 55.36,15.86 U$31.P$4 53.64,17.1 53.59,17.14 53.59,21.97 C23.2 55.36,23.73 U$23.P$4 53.64,24.97 53.59,25.02 53.59,29.84 C15.2 | 22.1,21.97 22.1,17.27 22.27,17.1 U$27.P$4 23.86,15.86 C27.2 22.1,14.09 22.1,9.4 22.27,9.22 U$35.P$4 23.86,7.99 C35.2 22.86,5.59 22.86,5.46 | 55.37,9.21 55.37,8.13 54.36,7.12 C39.2 54.48,6.86 54.48,6.1 53.72,5.33 | 23.11,5.33 22.99,5.33 22.86,5.46 | 45.59,5.33 53.72,5.33 | 23.11,5.33 29.84,5.33 | 29.84,5.33 37.85,5.33 | 22.86,5.46 22.99,5.46 23.11,5.33 | 37.85,5.33 45.59,5.33 | 22.86,5.46 22.86,5.33 20.19,5.33 | 20.19,5.33 17.02,5.33 17.02,4.45 | JP1.1 20.19,5.33
  Top 0.813: U$15.P$4 55.36,32.63 55.12,32.38 | 54.48,30.73 C15.2 | C2.2 15.11,38.73 | C17.2 6.35,21.97 | C25.2 6.35,14.09 | C19.2 22.1,21.97 | 55.37,9.21 U$39.P$4
  Top 1.016: 17.02,5.33 14.1,5.33 | Q1.2 16.06,3.49 17.02,4.45
  pour Top (isolate 0.406): 0,53.34 65.02,53.34 66.55,51.82 66.55,40.39 69.09,37.85 69.09,5.08 66.55,2.54 66.55,1.02 arc-90 65.53,0 0,0

### Text on the board
tNames: APA102 Shield V1.0 | Joseph Roddis 2016 | EXT VIN | PWR JMP | - +
ReferenceLC: L | TX | ON | RX | PC1 | PC2
214bmp: D:/SmartProjects/Snc/a4_bn_logo2.bmp